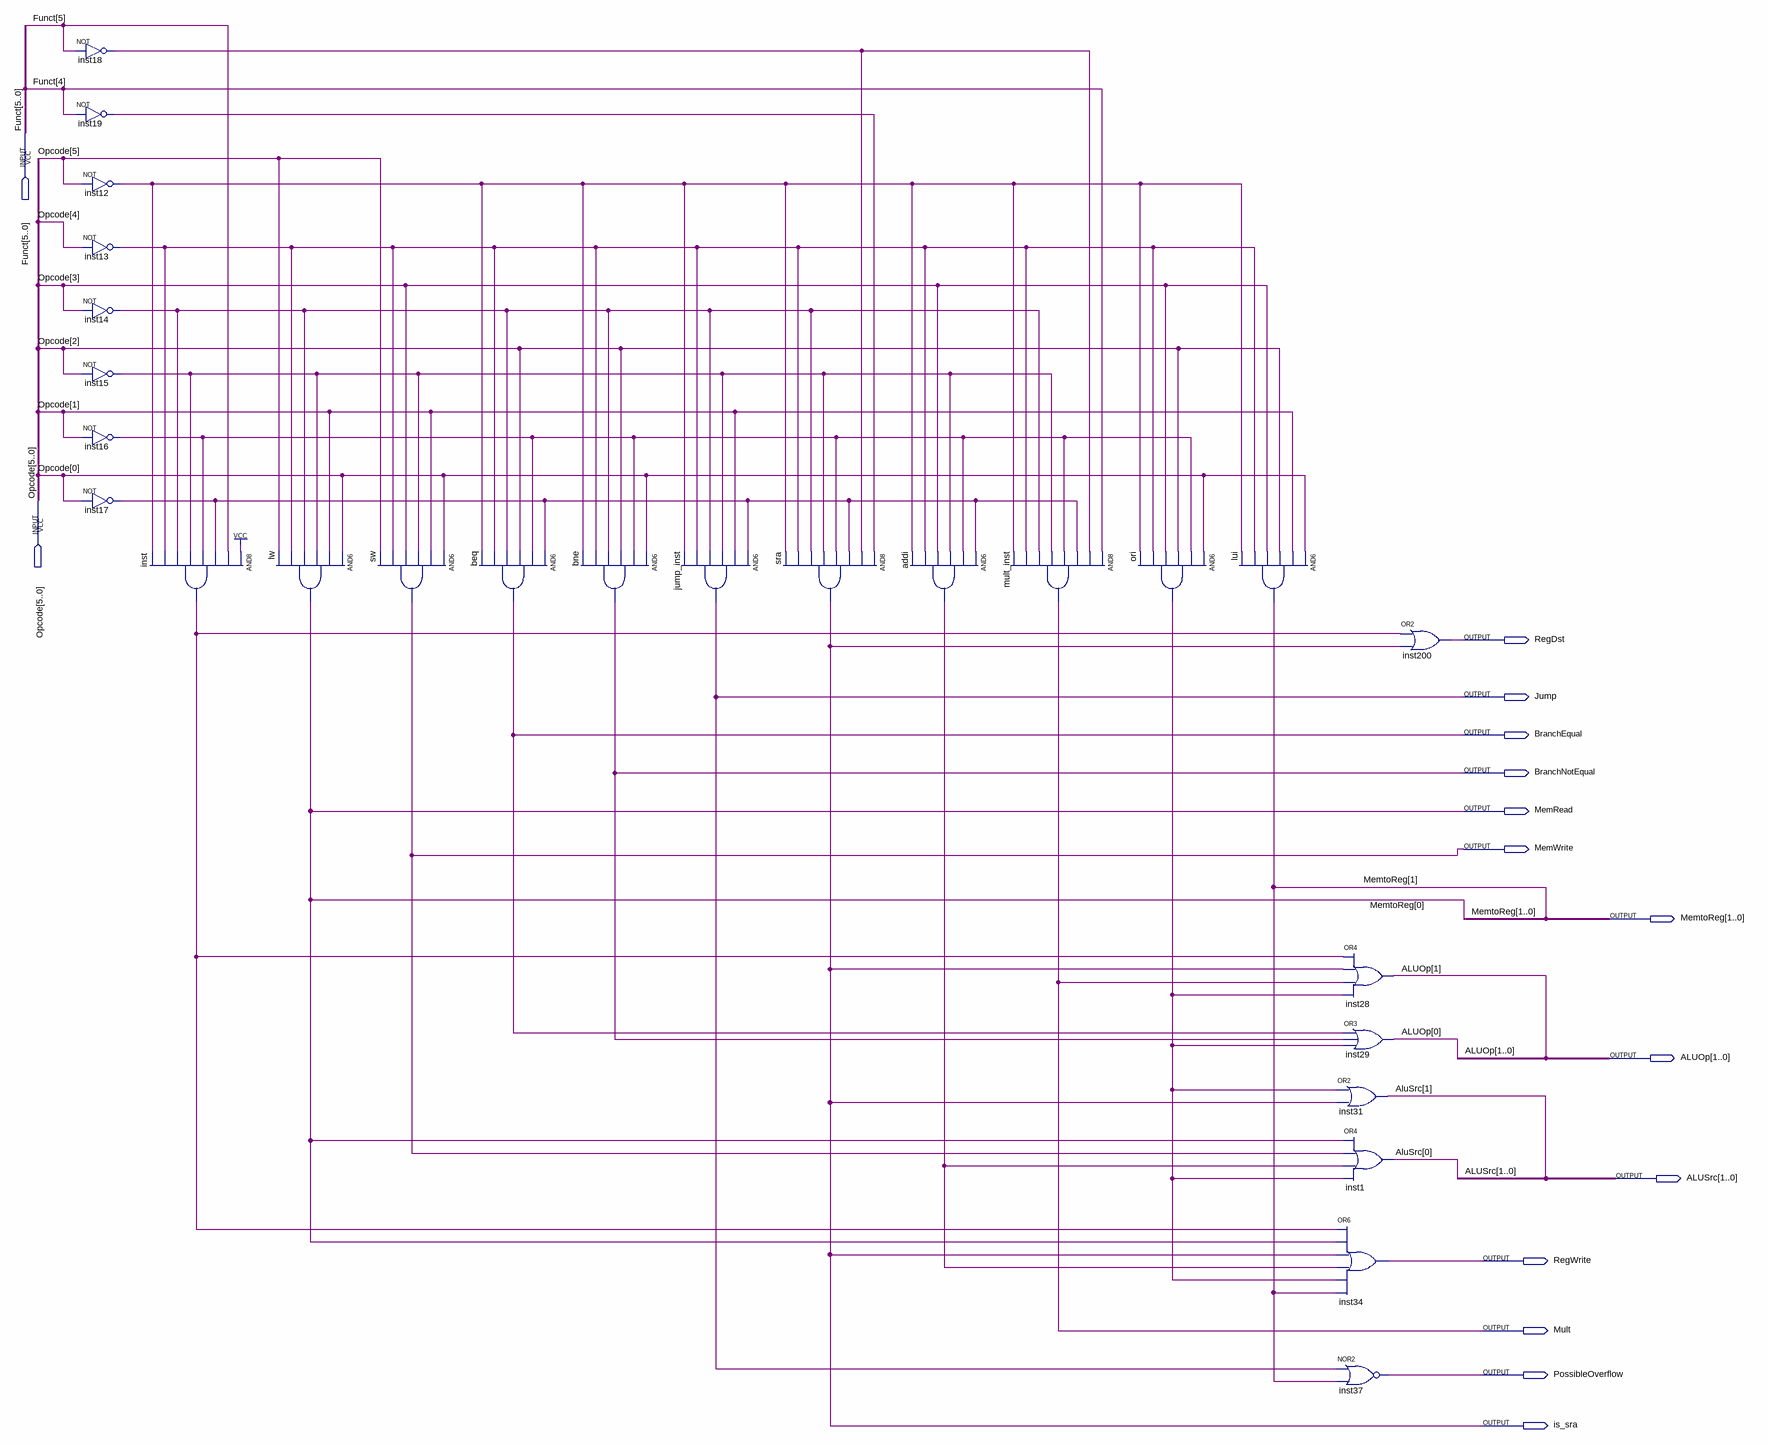
[diagram p0: schematic sheet]
// Quartus schematic Controle.bdf as structural Verilog: 26 symbols, 15 pins
module Controle (
  input  [5:0] Funct,
  input  [5:0] Opcode,
  output RegDst,
  output Jump,
  output BranchEqual,
  output BranchNotEqual,
  output MemRead,
  output MemWrite,
  output [1:0] MemtoReg,
  output [1:0] ALUOp,
  output [1:0] ALUSrc,
  output RegWrite,
  output Mult,
  output PossibleOverflow,
  output is_sra
);

  wire addi_out, inst12_out, inst13_out, inst14_out, inst15_out, inst16_out, inst17_out, inst18_out,
       inst19_out, inst_out, ori_out;

  not inst18 (inst18_out, Funct[5]);
  not inst19 (inst19_out, Funct[4]);
  not inst12 (inst12_out, Opcode[5]);
  not inst13 (inst13_out, Opcode[4]);
  not inst14 (inst14_out, Opcode[3]);
  not inst15 (inst15_out, Opcode[2]);
  not inst16 (inst16_out, Opcode[1]);
  not inst17 (inst17_out, Opcode[0]);
  and inst (inst_out, 1'b1, Funct[5], inst17_out, inst16_out, inst15_out, inst14_out, inst13_out, inst12_out);
  and lw (MemRead, Opcode[0], Opcode[1], inst15_out, inst14_out, inst13_out, Opcode[5]);
  and sw (MemWrite, Opcode[0], Opcode[1], inst15_out, Opcode[3], inst13_out, Opcode[5]);
  and beq (BranchEqual, inst17_out, inst16_out, Opcode[2], inst14_out, inst13_out, inst12_out);
  and bne (BranchNotEqual, Opcode[0], inst16_out, Opcode[2], inst14_out, inst13_out, inst12_out);
  and jump_inst (Jump, inst17_out, Opcode[1], inst15_out, inst14_out, inst13_out, inst12_out);
  and sra (is_sra, inst19_out, inst18_out, inst17_out, inst16_out, inst15_out, inst14_out, inst13_out, inst12_out);
  and addi (addi_out, inst17_out, inst16_out, inst15_out, Opcode[3], inst13_out, inst12_out);
  and mult_inst (Mult, Funct[4], inst18_out, inst17_out, inst16_out, inst15_out, inst14_out, inst13_out, inst12_out);
  and ori (ori_out, Opcode[0], inst16_out, Opcode[2], Opcode[3], inst13_out, inst12_out);
  and lui (MemtoReg[1], Opcode[0], Opcode[1], Opcode[2], Opcode[3], inst13_out, inst12_out);
  or inst28 (ALUOp[1], inst_out, is_sra, Mult, ori_out);
  or inst29 (ALUOp[0], BranchEqual, BranchNotEqual, ori_out);
  or inst31 (ALUSrc[1], ori_out, is_sra);
  or inst1 (ALUSrc[0], MemRead, MemWrite, addi_out, ori_out);
  or inst34 (RegWrite, inst_out, MemRead, is_sra, addi_out, ori_out, MemtoReg[1]);
  nor inst37 (PossibleOverflow, Jump, MemtoReg[1]);
  or inst200 (RegDst, inst_out, is_sra);

  assign MemtoReg[0] = MemRead;
endmodule
